# Altium project 1sVoltageMonitor.PrjPcb
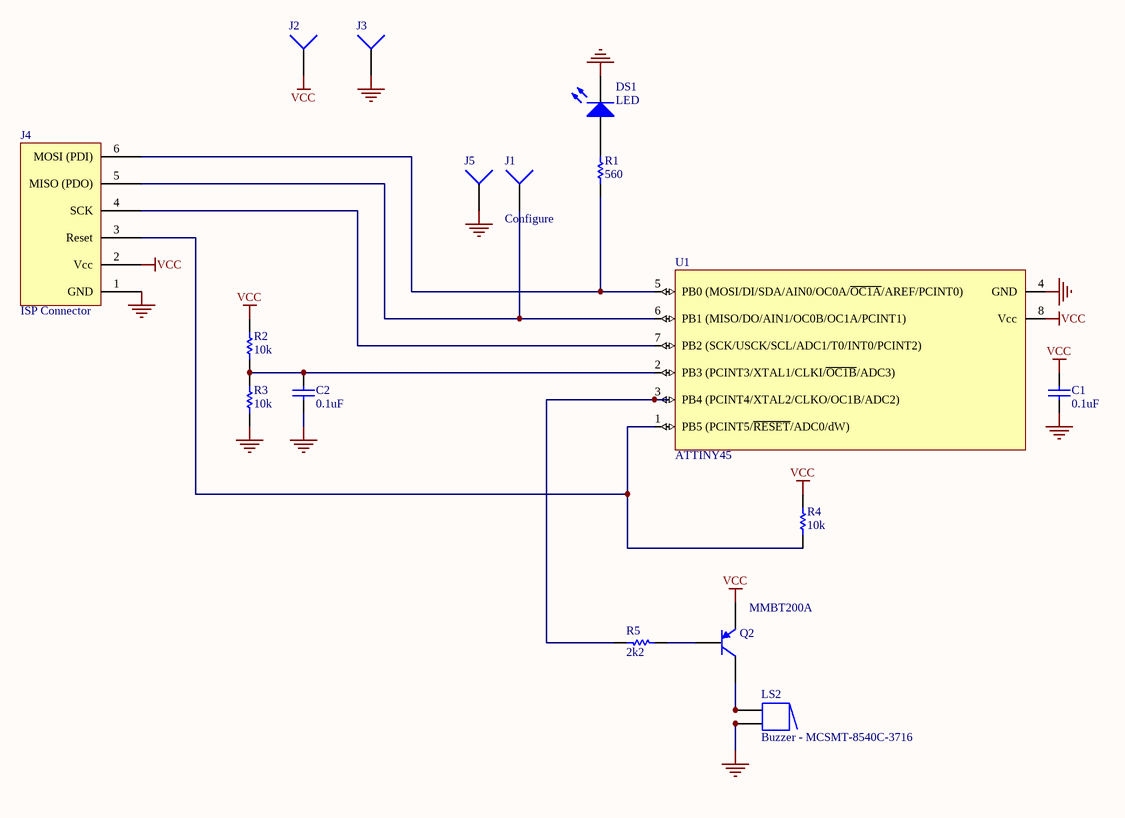
[diagram p0: 1sVoltageMonitor.SchDoc]
1 sheet, 16 parts. Net scope: global (net labels, ports and power ports of the same name join across sheets).

## Sheet 1sVoltageMonitor.SchDoc
size A4

### Parts
C1  value 0.1uF  [Cap SMD 0603]  (hidden comment: Cap)
C2  value 0.1uF  [Cap SMD 0603]  (hidden comment: Cap)
DS1  LED  [LED SMD 0603]
J1  Configure  [PIN1]
J2  (no value)  [PIN1]
J3  (no value)  [PIN1]
J4  ISP Connector  [HDR2X3]
J5  (no value)  [PIN1]
LS2  Buzzer - MCSMT-8540C-3716  [Buzzer MCSMT-8540C-3716]
Q2  MMBT200A  [SO-G3]
R1  value 560  [Res SMD 0603]  (hidden comment: Res1)
R2  value 10k  [Res SMD 0603]  (hidden comment: Res1)
R3  value 10k  [Res SMD 0603]  (hidden comment: Res1)
R4  value 10k  [Res SMD 0603]  (hidden comment: Res1)
R5  value 2k2  [Res SMD 0603]  (hidden comment: Res1)
U1  ATTINY45  [TSSOP8-4.4mm]

### Nets
GND: C1.1 C2.1 DS1.K J3.1 J4.1(GND) J5.1 LS2.2 LS2.2A R3.1 U1.4(GND)
VCC: C1.2 J2.1 J4.2(Vcc) Q2.E R2.2 R4.2 U1.8(Vcc)
NetC2_2: C2.2 R2.1 R3.2 U1.2(PB3_(PCINT3/XTAL1/CLKI/~{OC1B}/ADC3))
NetDS1_A: DS1.A R1.1
NetJ1_1: J1.1 J4.5(MISO_(PDO)) U1.6(PB1_(MISO/DO/AIN1/OC0B/OC1A/PCINT1))
NetJ4_3: J4.3(Reset) R4.1 U1.1(PB5_(PCINT5/~{RESET}/ADC0/dW))
NetJ4_4: J4.4(SCK) U1.7(PB2_(SCK/USCK/SCL/ADC1/T0/INT0/PCINT2))
NetJ4_6: J4.6(MOSI_(PDI)) R1.2 U1.5(PB0_(MOSI/DI/SDA/AIN0/OC0A/~{OC1A}/AREF/PCINT0))
NetLS2_1: LS2.1 LS2.1A Q2.C
NetQ2_B: Q2.B R5.1
NetR5_2: R5.2 U1.3(PB4_(PCINT4/XTAL2/CLKO/OC1B/ADC2))

### Library data of the parts
C1 C2 = Cap: Capacitor; Published: 8-Jun-2000; LatestRevisionDate: 17-Jul-2002; LatestRevisionNote: Re-released for DXP Platform.; PackageReference: RAD-0.3; Publisher: Altium Limited; PackageDescription: Radial Cap, Thru-Hole; 2 Leads; 0.3 in Pin Spacing
DS1 = LED: RGB LED Common Anode; Published: 8-Jun-2000; Revision: July-2002: Re-released for DXP Platform.; Publisher: Altium Limited
J1-J3 J5 = Socket: LatestRevisionDate: 17-Jul-2002; LatestRevisionNote: Re-released for DXP Platform.; Publisher: Altium Limited
J4 = ISP Connector: pin to pad: 1>6 3>5 4>3 5>1 6>4
LS2 = Buzzer: MCSMT-8540C-3716; pin to pad: 1>+ 1A>+ 2>- 2A>-; Published: 24-Mar-1999; LatestRevisionDate: 17-Dec-2003; LatestRevisionNote: Schematic revised, PCB Footprint replaced.; DatasheetVersion: 17-Dec-2003; PackageReference: ABSM-1574; Publisher: Altium Limited; PackageDescription: Magnetic Transducer Buzzer; ComponentLink1Description: Manufacturer Link; ComponentLink1URL: http://www.megastar.com/linecard/buzzmode/index.php
Q2 = MMBT200A: General Purpose Amplifier NPN Silicon; pin to pad: B>1 C>3 E>2; Package Information: Latest Revision: 1997; Published: 29-Sep-2000; Revision: 17-Jul-2002: Re-released for DXP Platform.; Datasheet: Latest Revision: 1996; Package Reference: 318-08; Publisher: Altium Limited
R1-R5 = Resistor